# EAGLE design sprite (EAGLE 9.0.1)
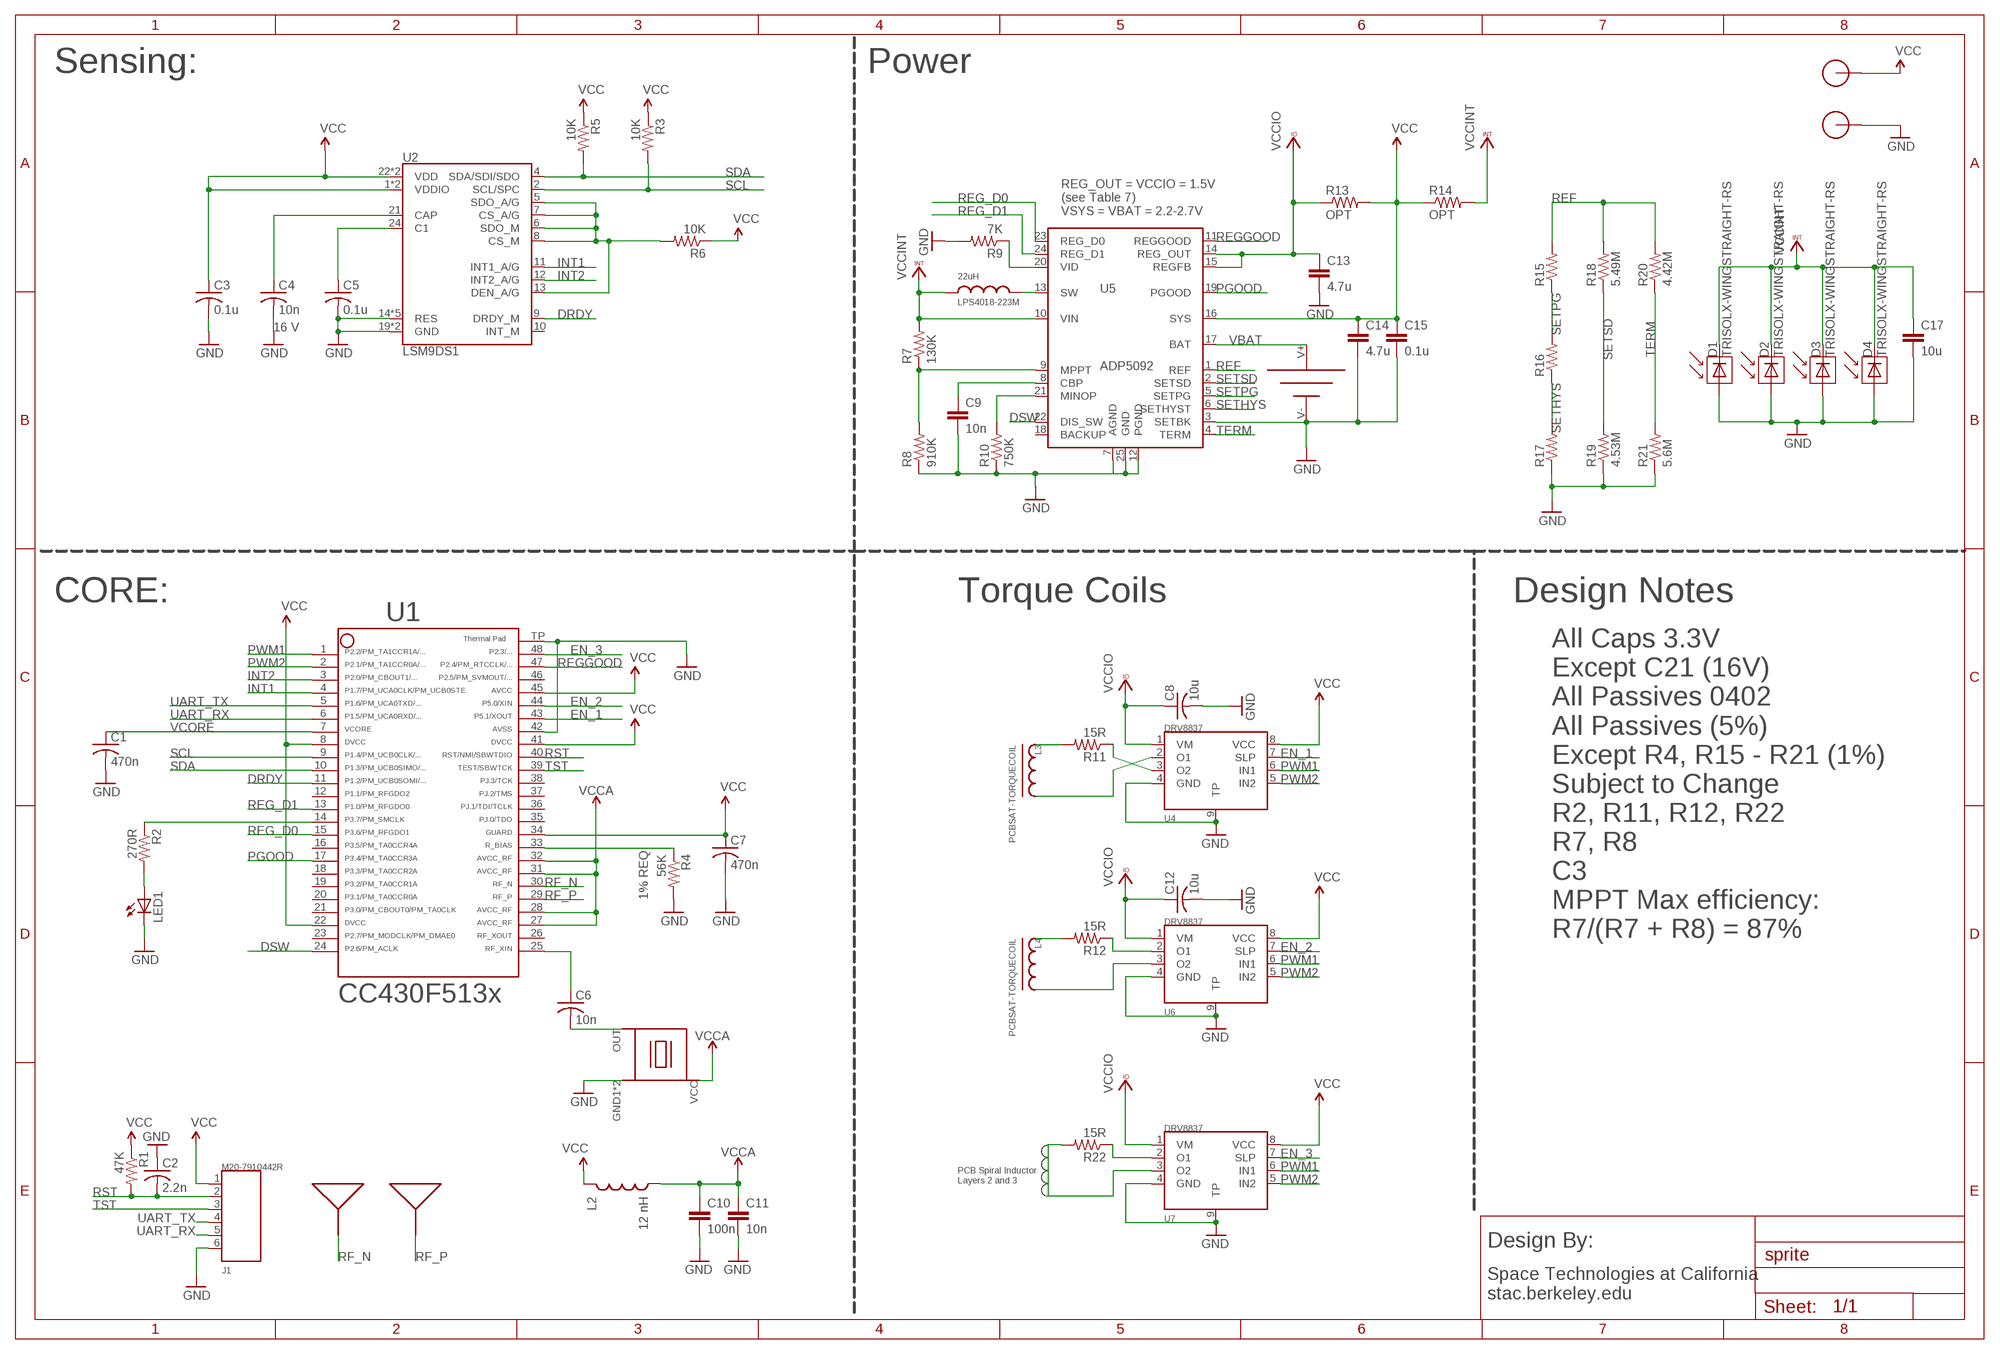
[diagram p0: schematic, sheet 1]

## Parts
A1  SPRITEANTENNA_ANTENNA  [SPRITEANTENNA_ANTENNA]
A2  SPRITEANTENNA_ANTENNA  [SPRITEANTENNA_ANTENNA]
B1  UMAC_UMAC  [UMAC_UMAC]
C1  470n  C-USC0402  [C0402]
C2  2.2n  C-USC0402  [C0402]
C3  0.1u  C-USC0402  [C0402]
C4  10n  C-USC0402  [C0402]
C5  0.1u  C-USC0402  [C0402]
C6  10n  C-USC0402  [C0402]
C7  470n  C-USC0402  [C0402]
C8  10u  C-USC0402  [C0402]
C9  10n  C-EUC0402  [C0402]
C10  100n  C-EUC0402  [C0402]
C11  10n  C-EUC0402  [C0402]
C12  10u  C-USC0402  [C0402]
C13  4.7u  C-EUC0402  [C0402]
C14  4.7u  C-EUC0402  [C0402]
C15  0.1u  C-EUC0402  [C0402]
C17  10u  C-EUC0402  [C0402]
D1  TRISOLX-WINGSTRAIGHT-RS  [TRISOLX-STRAIGHT-RS]
D2  TRISOLX-WINGSTRAIGHT-RS  [TRISOLX-STRAIGHT-RS]
D3  TRISOLX-WINGSTRAIGHT-RS  [TRISOLX-STRAIGHT-RS]
D4  TRISOLX-WINGSTRAIGHT-RS  [TRISOLX-STRAIGHT-RS]
J1  M20-7910442R  [M20-7910442R]
L1  LPS4018-223M  [LPS4018-223M]
L2  12 nH  INDUCTOR0603  [0603]
L3  PCBSAT-TORQUECOIL  [PCBSAT-TORQUECOIL]
L4  PCBSAT-TORQUECOIL  [PCBSAT-TORQUECOIL]
LED1  LED0603  [LED-0603]
R1  47K  R-US_R0402  [R0402]
R2  270R  R-US_R0402  [R0402]
R3  10K  R-US_R0402  [R0402]
R4  56K  R-US_R0402  [R0402]
R5  10K  R-US_R0402  [R0402]
R6  10K  R-US_R0402  [R0402]
R7  130K  R-US_R0402  [R0402]
R8  910K  R-US_R0402  [R0402]
R9  7K  R-US_R0402  [R0402]
R10  750K  R-US_R0402  [R0402]
R11  15R  R-US_R0402  [R0402]
R12  15R  R-US_R0402  [R0402]
R13  OPT  R-US_R0402  [R0402]
R14  OPT  R-US_R0402  [R0402]
R15  R-US_R0402  [R0402]
R16  R-US_R0402  [R0402]
R17  R-US_R0402  [R0402]
R18  5.49M  R-US_R0402  [R0402]
R19  4.53M  R-US_R0402  [R0402]
R20  4.42M  R-US_R0402  [R0402]
R21  5.6M  R-US_R0402  [R0402]
R22  15R  R-US_R0402  [R0402]
U1  CC430F513X  [TI_MSP430_V16_RGZ48]
U2  LSM9DS1  [LGA24-8X4]
U3  SPRITETCXO_TCXO_7Z  [SPRITETCXO_TXC_7Z]
U4  DRV8837  [SON50P200X200X75-8N]
U5  ADP5092  [QFN50P400X400X100-25N]
U6  DRV8837  [SON50P200X200X75-8N]
U7  DRV8837  [SON50P200X200X75-8N]
X1  SPRITEPIN_SPRITE_PIN  [SPRITEPIN_SPRITE_PIN]
X2  SPRITEPIN_SPRITE_PIN  [SPRITEPIN_SPRITE_PIN]

## Nets
DRDY: U1.11 U2.9(DRDY_M)
DSW: U1.24 U5.22(DIS_SW)
EN_1: U1.43 U4.7(SLP)
EN_2: U1.44 U6.7(SLP)
EN_3: U1.48 U7.7(SLP)
GND: B1.V- C1.2 C2.1 C3.2 C4.2 C5.2 C7.2 C8.2 C9.2 C10.2 C11.2 C12.2 C13.2 C14.2 C15.2 C17.2 D1.P$1(A) D2.P$1(A) D3.P$1(A) D4.P$1(A) J1.6 LED1.C R4.2 R8.1 R9.2 R10.1 R17.1 R19.1 R21.1 U1.42 U1.TP U2.14(RES) U2.15(RES) U2.16(RES) U2.17(RES) U2.18(RES) U2.19(GND) U2.20(GND) U3.GND1(GND) U3.GND2(GND) U4.4(GND) U4.9(TP) U5.3(SETBK) U5.7(AGND) U5.12(PGND) U5.25(GND) U6.4(GND) U6.9(TP) U7.4(GND) U7.9(TP) X2.PIN
INT1: U1.4 U2.11(INT1_A/G)
INT2: U1.3 U2.12(INT2_A/G)
N$1: C6.1 U1.25
N$2: R2.1 U1.14
N$3: R4.1 U1.33
N$4: L3.1 R11.2
N$5: C5.1 U2.24(C1)
N$6: C4.1 U2.21(CAP)
N$7: R6.2 U2.5(SDO_A/G) U2.6(SDO_M) U2.7(CS_A/G) U2.8(CS_M) U2.13(DEN_A/G)
N$8: R11.1 U4.3(O2)
N$9: L4.1 R12.2
N$11: LED1.A R2.2
N$12: C6.2 U3.OUT
N$13: R22.1 U7.2(O1)
N$14: L3.2 U4.2(O1)
N$16: R9.1 U5.20(VID)
N$18: R7.1 R8.2 U5.9(MPPT)
N$20: R10.2 U5.21(MINOP)
N$21: C9.1 U5.8(CBP)
N$22: L1.P$2 U5.13(SW)
N$26: R12.1 U6.2(O1)
N$27: L4.2 U6.3(O2)
N$28: R22.2 U7.3(O2)
PGOOD: U1.17 U5.19(PGOOD)
PWM1: U1.1 U4.6(IN1) U6.6(IN1) U7.6(IN1)
PWM2: U1.2 U4.5(IN2) U6.5(IN2) U7.5(IN2)
REF: R15.2 R18.2 R20.2 U5.1(REF)
REG_D0: U1.15 U5.23(REG_D0)
REG_D1: U1.13 U5.24(REG_D1)
REGGOOD: U1.47 U5.11(REGGOOD)
RF_N: A1.IN1(IN) A1.IN2(IN) A1.IN3(IN) U1.30
RF_P: A2.IN1(IN) A2.IN2(IN) A2.IN3(IN) U1.29
RST: C2.2 J1.2 R1.2 U1.40
SCL: R3.2 U1.9 U2.2(SCL/SPC)
SDA: R5.2 U1.10 U2.4(SDA/SDI/SDO)
SETHYS: R16.1 R17.2 U5.6(SETHYST)
SETPG: R15.1 R16.2 U5.5(SETPG)
SETSD: R18.1 R19.2 U5.2(SETSD)
TERM: R20.1 R21.2 U5.4(TERM)
TST: J1.3 U1.39
UART_RX: J1.5 U1.6
UART_TX: J1.4 U1.5
VBAT: B1.V+ U5.17(BAT)
VCC: C3.1 C7.1 C14.1 C15.1 J1.1 L2.1 R1.1 R3.1 R5.1 R6.1 R13.2 R14.1 U1.8 U1.22 U1.34 U1.41 U1.45 U2.1(VDDIO) U2.3(VDDIO) U2.22(VDD) U2.23(VDD) U4.8(VCC) U5.16(SYS) U6.8(VCC) U7.8(VCC) X1.PIN
VCCA: C10.1 C11.1 L2.2 U1.27 U1.28 U1.31 U1.32 U3.VCC
VCCINT: C17.1 D1.P$2(C) D2.P$2(C) D3.P$2(C) D4.P$2(C) L1.P$1 R7.2 R14.2 U5.10(VIN)
VCCIO: C8.1 C12.1 C13.1 R13.1 U4.1(VM) U5.14(REG_OUT) U5.15(REGFB) U6.1(VM) U7.1(VM)
VCORE: C1.1 U1.7
Unconnected: U1.12 U1.16 U1.18 U1.19 U1.20 U1.21 U1.23 U1.26 U1.35 U1.36 U1.37 U1.38 U1.46 U2.10(INT_M) U5.18(BACKUP)

## Notes on the sheet
- Sensing: | Power
- REG_OUT = VCCIO = 1.5V
  (see Table 7)
  VSYS = VBAT = 2.2-2.7V
- 16 V
- CORE: | Torque Coils | Design Notes
- 1% REQ
- All Caps 3.3V
  Except C21 (16V)
  All Passives 0402 
  All Passives (5%)
  Except R4, R15 - R21 (1%) 
  Subject to Change
  R2, R11, R12, R22
  R7, R8
  C3
  MPPT Max efficiency:
  R7/(R7 + R8) = 87%
- PCB Spiral Inductor
  Layers 2 and 3
- Design By:
- Space Technologies at California
  stac.berkeley.edu

## Library data of the parts
A1 A2 = STAC:SPRITEANTENNA_ANTENNA
B1 = STAC:UMAC_UMAC
C1-C8 C12 = rcl:C-US: CAPACITOR, American symbol; SPICEPREFIX: C
C9-C11 C13-C15 C17 = resistor:C-EU: CAPACITOR, European symbol
D1-D4 = STAC:TRISOLX-WING
J1 = STAC:M20-7910442R
L1 = STAC:LPS4018-223M: Datasheet: https://www.mouser.com/datasheet/2/597/lps4018-270702.pdf
L2 = SparkFun:INDUCTOR: Inductors Basic Inductor/Choke - 0603 and 1206. Footprints are not proven and vary greatly between part numbers.
L3 L4 = STAC:PCBSAT-TORQUECOIL
LED1 = SparkFun:LED: LEDs Standard schematic elements and footprints for 5mm, 3mm, 1206, and 0603 sized LEDs. 5mm - Spark Fun Electronics SKU : COM-00529 (and others)
R1-R22 = resistor:R-US_: RESISTOR, American symbol
U1 = STAC:CC430F513X: ***CC430F513X***RGZ48 ** ** Rev 1.0 ** 06/2010 * http://focus.ti.com/docs/prod/folders/print/cc430f5137.html
U2 = SparkFun-Sensors:LSM9DS1: LSM9DS1 3D accelerometer, gyroscope & magnetometer The LSM9DS1 is a system-in-package featuring a 3D digital linear acceleration sensor, a 3D digital angular rate sensor, and a 3D digital magnetic sensor. The LSM9DS1 has a linear acceleration full scale of ±2g/±4g/±8/±16 g, a magnetic field full scale of ±4/±8/±12/±16 gauss and an angular rate of ±245/±500/±2000 dps. The LSM9DS1 includes an I2 C serial bus interface supporting standard and fast mode (100 kHz and 400 kHz) and an SPI serial standard interface. Magnetic, accelerometer and gyroscope sensing can be enabled or set in power-down mode separately for smart power management. The LSM9DS1 is available in a plastic land grid array package (LGA) and it is guaranteed to operate over an extended temperature range from -40 °C to +85 °C.; PROD_ID: IC-12536
U3 = STAC:SPRITETCXO_TCXO_7Z
U4 U6 U7 = STAC:DRV8837
U5 = STAC:ADP5092
X1 X2 = STAC:SPRITEPIN_SPRITE_PIN

## Board
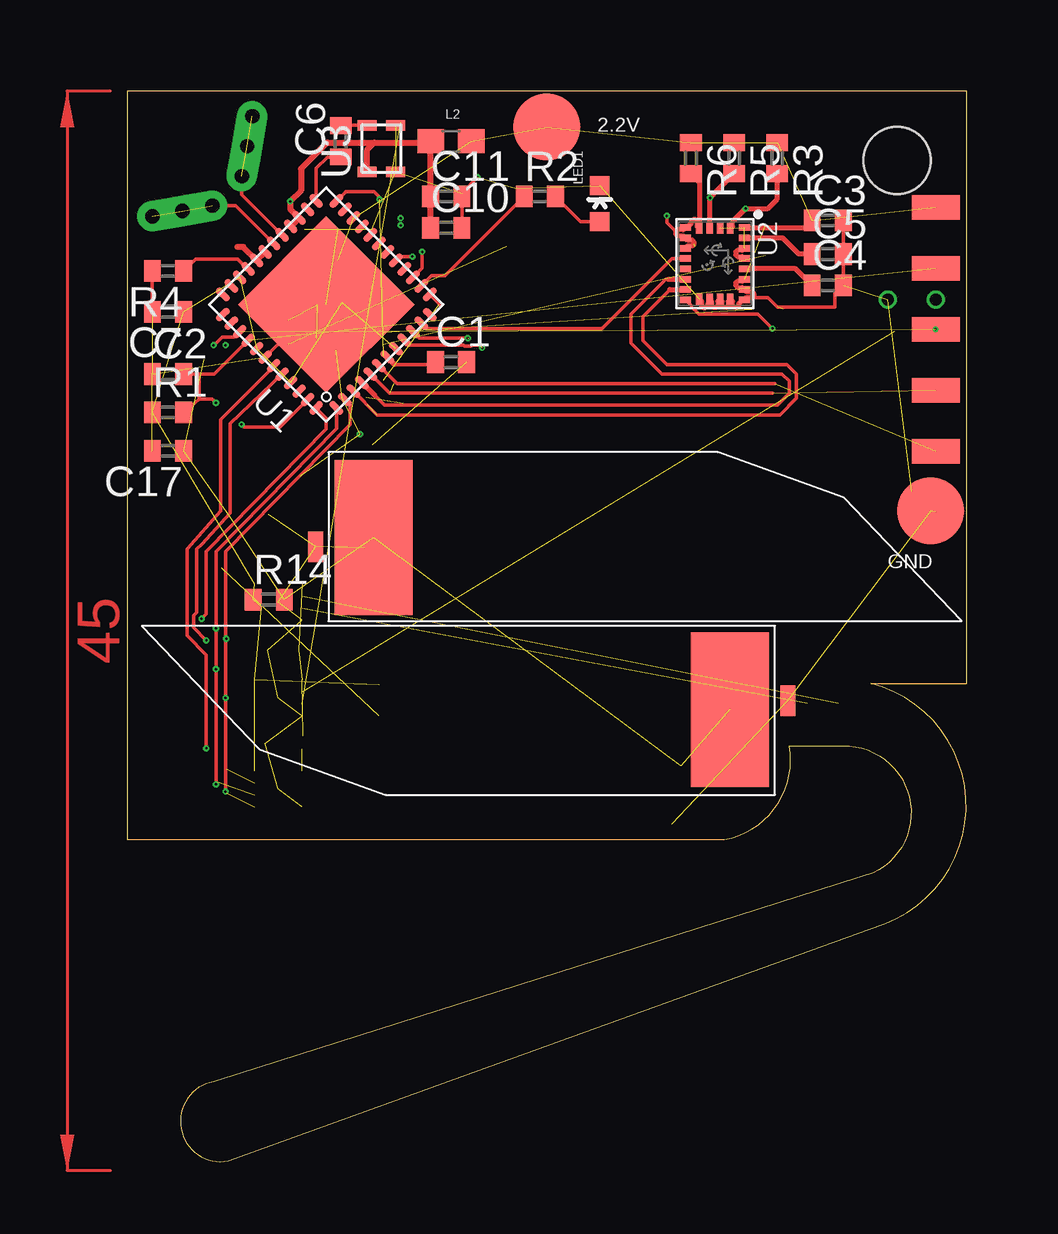
[diagram p1: board, top side]
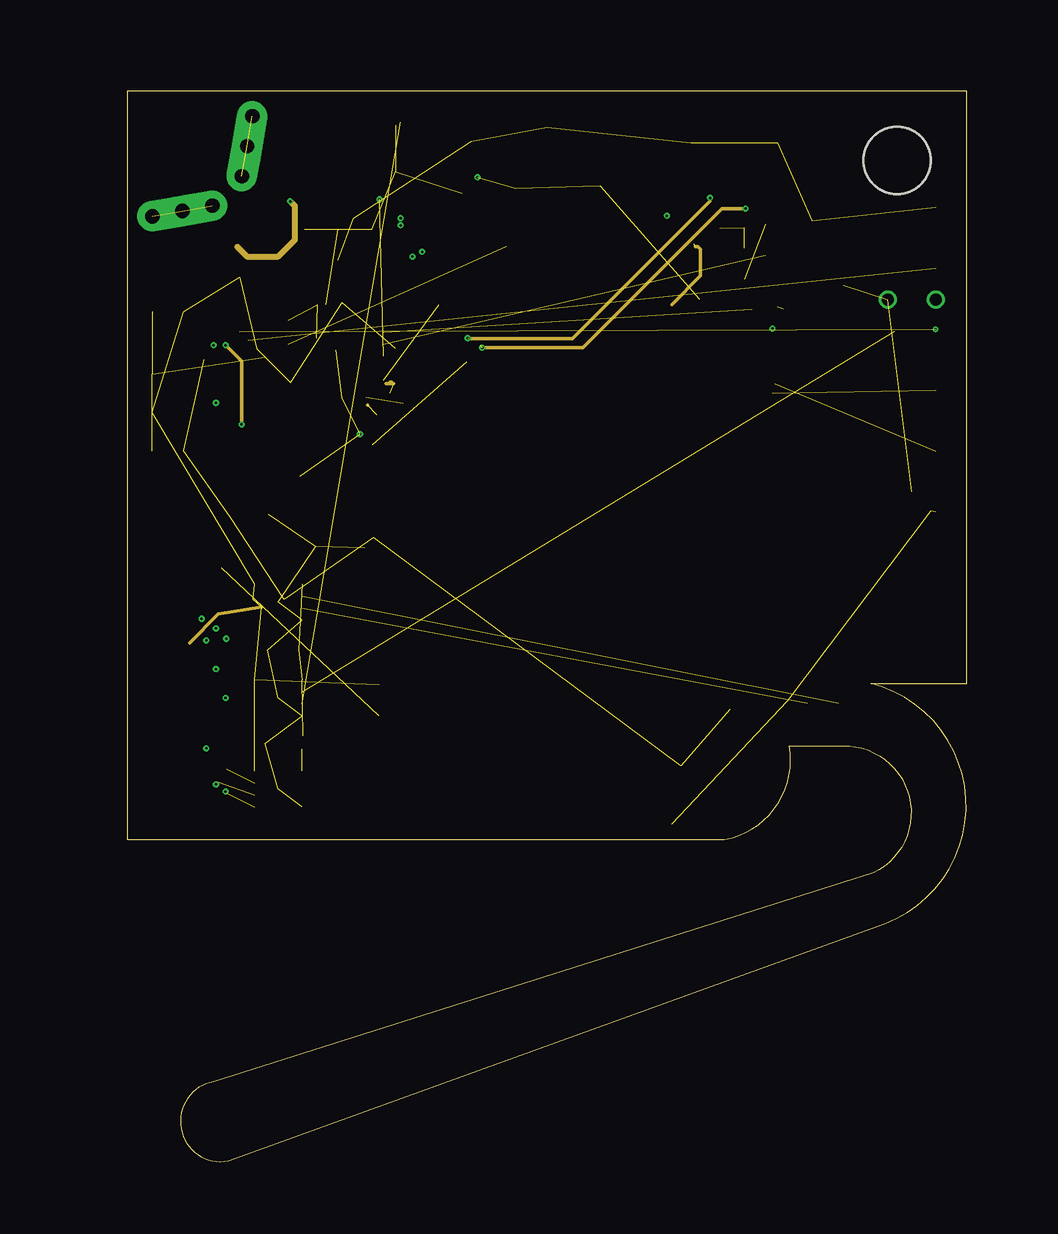
[diagram p2: board, inner layer Route2]
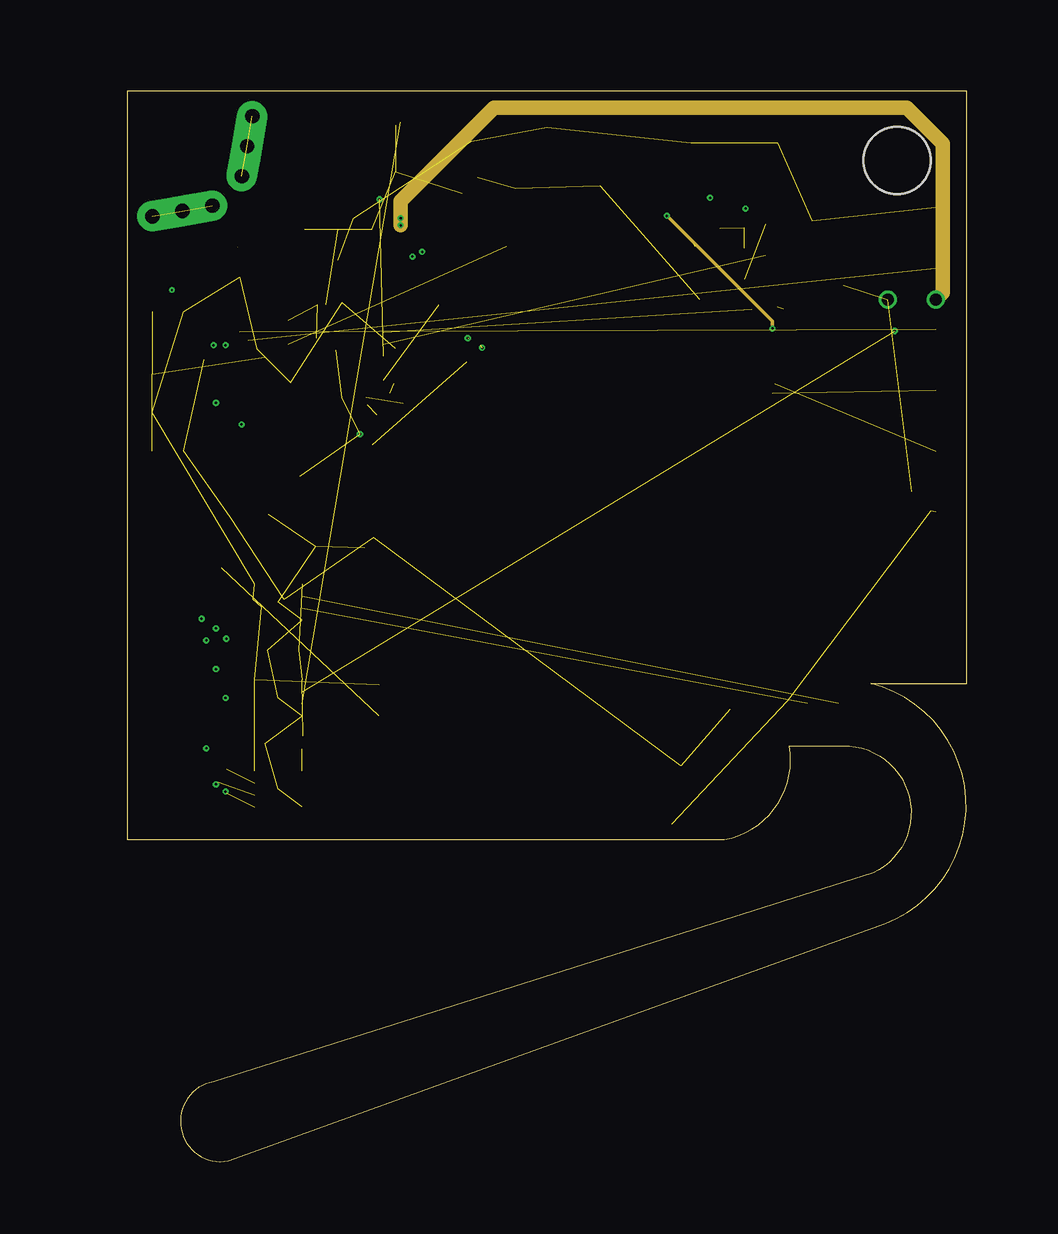
[diagram p3: board, inner layer Route3]
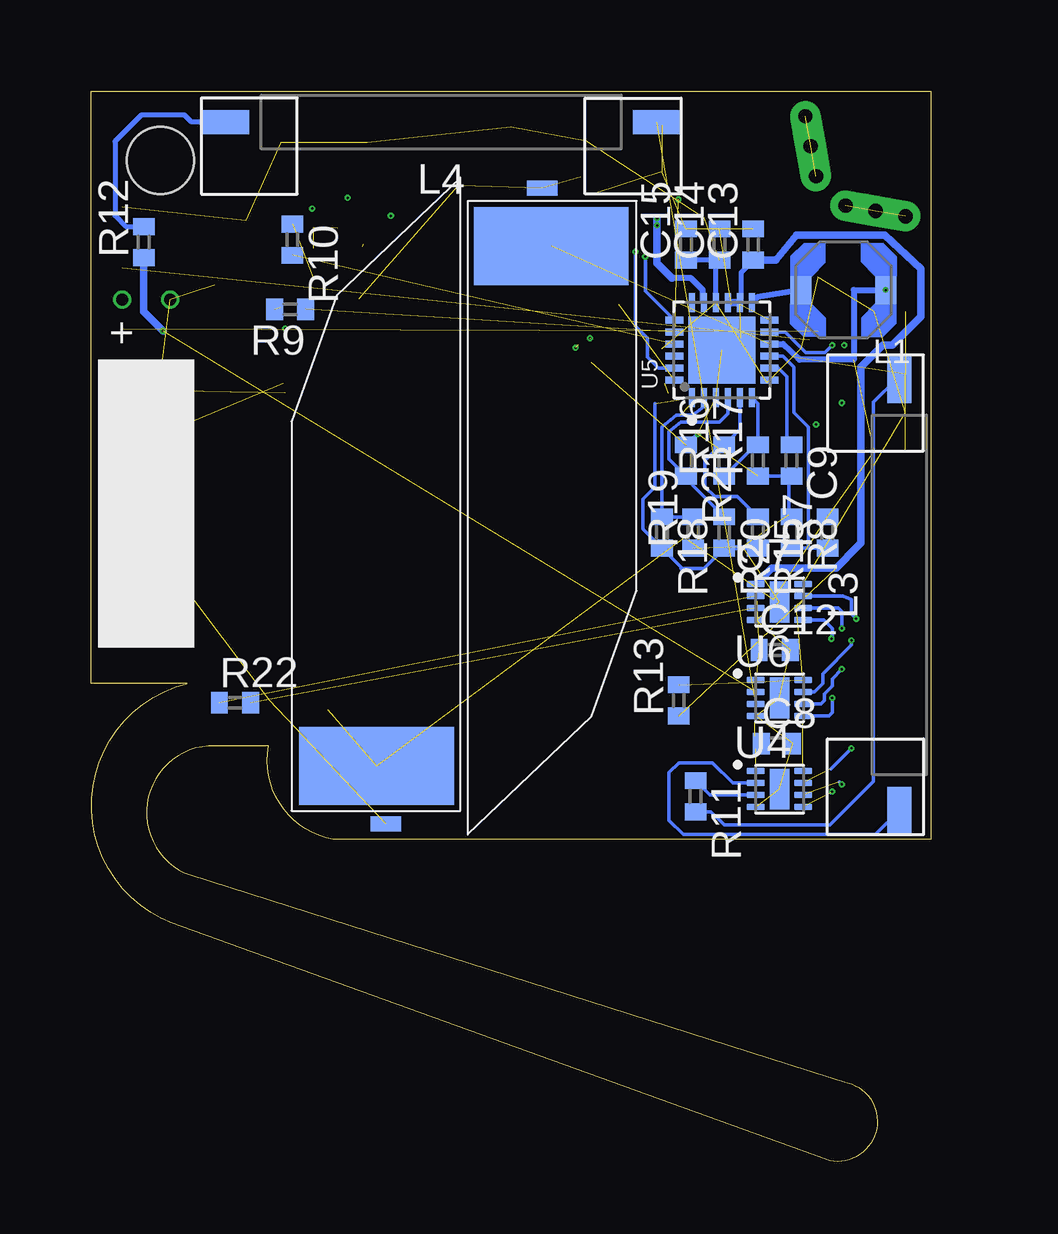
[diagram p4: board, bottom side, seen from below]

Size 35 x 44.63 mm. Coordinates in mm from the lower left corner, seen from the top.
Outline: 0,13.43 24.9,13.43 arc90 27.6,17.33 30.1,17.33 arc-150 31.1,12.03 3.6,3.33 arc180 4.2,0.03 31.6,9.93 arc145 31,19.93 35,19.93 35,44.63 0,44.63 0,13.43
Copper layers [2:(1+2*3+16):3]: Top 0.053340625mm / dielectric 10mil / Route2 0.035559375mm / dielectric 14mil / Route3 0.035559375mm / dielectric 10mil / Bottom 0.053340625mm
Design rules "BayAreaAdvanced *": minimum track width 2mil, minimum drill 4mil, track to track 2mil, track to pad 5mil, pad to pad 5mil, via to via 5mil, smd to smd 5mil, copper to edge 5mil, drill to drill 6mil, minimum pad ring 3mil, minimum via ring 3mil, stop-mask expansion 4mil, vias tented up to drill 0mil, thermal gap 10mil
Holes 2.8 mm at 32.1,41.73

### Footprints (pad centres in the part's own frame; a part is rotated, then mirrored left to right if it is on the bottom)
SPRITEANTENNA_ANTENNA = drill 0.6 pad 1.27 square: IN1 0,0 | drill 0.6 pad 1.27 offset: IN2 1.27,0; IN3 -1.27,0
UMAC_UMAC = drill 0.5: V+ 2.5,1; V- 2.5,-1
C0402 = smd 0.7 x 0.9: 1 -0.65,0; 2 0.65,0
TRISOLX-STRAIGHT-RS = smd 0.635 x 1.27: P$1 -12.446,0.508 | smd 3.251 x 6.452: P$2 -10.033,0.889
M20-7910442R = smd 1.02 x 2: 1 -6.35,0; 2 -3.81,0; 3 -1.27,0; 4 1.27,0; 5 3.81,0; 6 6.35,0
LPS4018-223M = smd 0.87 x 1.15: P$1 -1.765,0; P$2 1.765,0
0603 = smd 1.1 x 1: 1 -0.85,0; 2 0.85,0
PCBSAT-TORQUECOIL = smd 2 x 1: 1 -9,0; 2 9,0
LED-0603 = smd 0.8 x 0.8: A 0,-0.75; C 0,0.75
R0402 = smd 0.7 x 0.9: 1 -0.65,0; 2 0.65,0
TI_MSP430_V16_RGZ48 = smd 0.7 x 0.3: 1 -3.35,2.75; 2 -3.35,2.25; 3 -3.35,1.75; 4 -3.35,1.25; 5 -3.35,0.75; 6 -3.35,0.25; 7 -3.35,-0.25; 8 -3.35,-0.75; 9 -3.35,-1.25; 10 -3.35,-1.75; 11 -3.35,-2.25; 12 -3.35,-2.75; 25 3.35,-2.75; 26 3.35,-2.25; 27 3.35,-1.75; 28 3.35,-1.25; 29 3.35,-0.75; 30 3.35,-0.25; 31 3.35,0.25; 32 3.35,0.75; 33 3.35,1.25; 34 3.35,1.75; 35 3.35,2.25; 36 3.35,2.75 | smd 0.3 x 0.7: 13 -2.75,-3.35; 14 -2.25,-3.35; 15 -1.75,-3.35; 16 -1.25,-3.35; 17 -0.75,-3.35; 18 -0.25,-3.35; 19 0.25,-3.35; 20 0.75,-3.35; 21 1.25,-3.35; 22 1.75,-3.35; 23 2.25,-3.35; 24 2.75,-3.35; 37 2.75,3.35; 38 2.25,3.35; 39 1.75,3.35; 40 1.25,3.35; 41 0.75,3.35; 42 0.25,3.35; 43 -0.25,3.35; 44 -0.75,3.35; 45 -1.25,3.35; 46 -1.75,3.35; 47 -2.25,3.35; 48 -2.75,3.35 | smd 5.2 x 5.2: TP 0,0
LGA24-8X4 = smd 0.27 x 0.45: 1 -1.505,1.225; 6 -1.505,-1.225; 7 -1.075,-1.225; 8 -0.645,-1.225; 9 -0.215,-1.225; 10 0.215,-1.225; 11 0.645,-1.225; 12 1.075,-1.225; 13 1.505,-1.225; 18 1.505,1.225; 19 1.075,1.225; 20 0.645,1.225; 21 0.215,1.225; 22 -0.215,1.225; 23 -0.645,1.225; 24 -1.075,1.225 | smd 0.45 x 0.27: 2 -1.475,0.645; 3 -1.475,0.215; 4 -1.475,-0.215; 5 -1.475,-0.645; 14 1.475,-0.645; 15 1.475,-0.215; 16 1.475,0.215; 17 1.475,0.645
SPRITETCXO_TXC_7Z = smd 0.44 x 0.79: GND1 -0.97,-0.595; GND2 0.97,-0.595; OUT 0.97,0.595; VCC -0.97,0.595
SON50P200X200X75-8N = smd 0.76 x 0.27: 1 -0.985,0.75; 2 -0.985,0.25; 3 -0.985,-0.25; 4 -0.985,-0.75; 5 0.985,-0.75; 6 0.985,-0.25; 7 0.985,0.25; 8 0.985,0.75 | smd 0.81 x 1.7: 9 0,0
QFN50P400X400X100-25N = smd 0.76 x 0.26: 1 -1.98,1.25; 2 -1.98,0.75; 3 -1.98,0.25; 4 -1.98,-0.25; 5 -1.98,-0.75; 6 -1.98,-1.25; 13 1.98,-1.25; 14 1.98,-0.75; 15 1.98,-0.25; 16 1.98,0.25; 17 1.98,0.75; 18 1.98,1.25 | smd 0.26 x 0.76: 7 -1.25,-1.98; 8 -0.75,-1.98; 9 -0.25,-1.98; 10 0.25,-1.98; 11 0.75,-1.98; 12 1.25,-1.98; 19 1.25,1.98; 20 0.75,1.98; 21 0.25,1.98; 22 -0.25,1.98; 23 -0.75,1.98; 24 -1.25,1.98 | smd 2.8 x 2.8: 25 0,0
SPRITEPIN_SPRITE_PIN = smd 2.794 x 2.794: PIN 0,0

### Placement (x,y rotation side)
A1  2.3,39.63 10 top
A2  5,42.33 80 top
B1  32.7,33.43 90 bottom
C1  13.5,33.33 0 top
C2  1.7,32.83 0 top
C3  29.2,39.23 0 top
C4  29.2,36.53 0 top
C5  29.2,37.83 0 top
C6  8.9,42.53 90 top
C7  1.7,35.43 180 top
C8  6.4,17.43 0 bottom
C9  5.8,29.23 270 bottom
C10  13.3,38.93 0 top
C11  13.3,40.23 0 top
C12  6.5,21.33 0 bottom
C13  7.4,38.23 90 bottom
C14  8.8,38.23 90 bottom
C15  10.2,38.23 90 bottom
C17  1.7,29.63 180 top
D1  15.1,19.73 180 top
D2  20.3,25.13 0 top
D3  16.7,28.13 270 bottom
D4  22.2,26.53 90 bottom
J1  33.7,33.43 270 top
L1  3.63,36.33 180 bottom
L2  13.5,42.53 180 top
L3  1.3,23.63 270 bottom
L4  20.4,43.33 0 bottom
LED1  19.7,39.93 0 top
R1  1.7,31.23 0 top
R2  17.2,40.23 0 top
R3  27.1,41.83 270 top
R4  1.7,37.13 180 top
R5  25.3,41.83 270 top
R6  23.5,41.83 270 top
R7  4.3,26.23 90 bottom
R8  5.8,26.23 270 bottom
R9  26.7,35.53 180 bottom
R10  26.6,38.43 270 bottom
R11  9.8,15.23 270 bottom
R12  32.8,38.33 90 bottom
R13  10.5,19.23 90 bottom
R14  5.9,23.43 0 top
R15  7.2,26.23 270 bottom
R16  8.6,29.23 90 bottom
R17  7.2,29.23 90 bottom
R18  11.2,26.23 270 bottom
R19  9.9,26.23 90 bottom
R20  8.6,26.23 270 bottom
R21  10.2,29.23 270 bottom
R22  29,19.13 0 bottom
U1  8.3,35.73 135 top
U2  24.5,37.43 270 top
U3  10.6,42.23 90 top
U4  6.3,15.53 0 bottom
U5  8.7,33.83 90 bottom
U6  6.3,19.33 0 bottom
U7  6.3,23.33 0 bottom
X1  17.5,43.13 0 top
X2  33.5,27.13 0 top

### Tracks (layer width: path | path; a pad name or v marks a point on that pad's centre or on a via)
DRDY
  Top 0.152: U2.9 22.71,37.64 19.8,34.73 12.48,34.73 U1.11
DSW  (via drill 0.1)  (1 unrouted)
  Top 0.152: U1.24 9.1,40.42 9.1,40.43 10.3,40.43 10.5,40.23 10.5,40.13 v10.52,40.11
EN_1  (via drill 0.1)  (1 unrouted)
  Top 0.152: U1.43 6.11,33.13 3.9,30.93 3.9,27.13 2.5,25.53 2.5,21.93 3.3,21.13 v3.3,17.23
  Bottom 0.152: v3.3,17.23 4.15,16.38
EN_2  (via drill 0.1)
  Top 0.152: U1.44 4.3,30.77 4.3,27.03 3.1,25.73 2.9,25.53 2.9,22.89 2.77,22.76 2.77,22.26 v3.3,21.73
  Bottom 0.152: U6.7 4.85,19.58 4.5,19.93 4.5,20.33 3.3,21.53 v3.3,21.73
EN_3  (via drill 0.1)
  Top 0.152: v3.1,22.63 3.3,22.83 3.3,25.43 8.3,30.53 8.3,30.99 U1.48
  Bottom 0.152: v3.1,22.63 3.3,22.83 3.3,23.43 3.65,23.58 U7.7
GND  (via drill 0.1, 0.1 layers 1-2)  (36 unrouted)
  Top 0.152: R4.2 C7.2 | C10.2 C11.2 13.95,40.38 v14.6,41.03 | C3.2 C5.2 C4.2 29.5,36.18 29.5,35.63 27.1,35.63 26.72,36.01 26.05,36.01 | U1.42 7.95,35.73 U1.TP | U3.GND2 11.2,43.33
  Top 0.203: U2.20 25.64,36.69 25.45,36.69 25.37,36.62 25.37,36.51 25.45,36.44 25.64,36.44 U2.19 25.81,36.26 26.05,36.26 26.13,36.19 26.13,36.08 26.05,36.01 25.81,36.01 U2.18 25.7,35.95 25.49,35.74 25.49,35.67 25.41,35.6 25.31,35.6 25.23,35.67 25.23,35.86 U2.17 25.06,35.86 25.06,35.67 24.98,35.6 24.88,35.6 24.8,35.67 24.8,35.86 U2.16 24.63,35.86 24.63,35.67 24.55,35.6 24.45,35.6 24.37,35.67 24.37,35.86 24.36,35.88 | 24.36,35.88 U2.15 | 24.36,35.88 24.2,35.72 24.2,35.67 24.12,35.6 24.02,35.6 23.94,35.67 23.94,35.86 U2.14
  Top 0.508: X2.PIN 32.7,27.93
  Bottom 0.152: C9.2 5.9,28.58 | 5.9,28.58 R17.1 | R8.1 5.9,26.98 5.9,28.58 | R21.1 9.75,30.33 v9.7,30.33
  Bottom 0.203: 7.9,34.33 U5.25
INT1
  Top 0.152: 10.33,31.93 10.73,31.53 27.1,31.53 27.6,32.03 27.6,32.53 27.3,32.83 22.3,32.83 21,34.13 21,35.33 22.45,36.78 22.55,36.78
  Top 0.203: U1.4 10.33,31.93 | 22.55,36.78 U2.11
INT2  (1 unrouted)
  Top 0.152: 22.62,36.35 21.5,35.23 21.5,34.23 22.5,33.23 27.5,33.23 27.9,32.83 27.9,31.83 27.2,31.13 10.43,31.13 U1.3
  Top 0.203: 22.62,36.35 U2.12
  Route2 0.152: 10.01,31.54 10.03,31.53
N$1
  Top 0.152: C6.1 8.35,41.88 7.88,41.4 U1.25
N$2
  Top 0.152: U1.14 12.68,36.93 13.25,36.93 R2.1
N$3
  Top 0.152: U1.33 5.01,37.21 4.6,37.63 2.85,37.63 R4.1
N$4
  Bottom 0.152: L3.1 1.41,32.63 2.38,31.66 2.38,15.85 4.2,14.03 8.6,14.03 9.15,14.58 R11.2
N$5
  Top 0.203: C5.1 28,37.83 27.32,38.5 U2.24
N$6
  Top 0.203: C4.1 27.86,37.21 U2.21
N$7  (via drill 0.1)  (1 unrouted)
  Top 0.152: 23.35,38.14 U2.8 | U2.13 23.52,35.68 23.52,35.64 23.83,35.33 26.3,35.33 v26.9,34.73 | 22.87,38.77 22.5,39.14 v22.5,39.43
  Top 0.203: R6.2 23.86,40.82 U2.5 23.77,38.99 23.77,39.18 23.69,39.25 23.59,39.25 23.51,39.18 23.51,39.11 23.3,38.9 U2.6 23.19,38.84 22.95,38.84 22.87,38.77 22.87,38.66 22.95,38.59 23.19,38.59 U2.7 23.36,38.41 23.55,38.41 23.63,38.34 23.63,38.23 23.55,38.16 23.36,38.16 U2.8
  Route2 0.152: 22.7,35.73 23.9,36.93 23.9,38.03 23.78,38.14 23.68,38.14
  Route3 0.152: v22.5,39.43 26.9,35.03 v26.9,34.73
N$8
  Bottom 0.152: U4.3 9.2,15.28 R11.1
N$9
  Bottom 0.203: L4.1 30.8,43.33 31.1,43.63 32.9,43.63 34,42.53 34,39.43 33.55,38.98 R12.2
N$11
  Top 0.152: R2.2 18.9,39.18 LED1.A
N$12
  Top 0.152: C6.2 8.92,43.2 U3.OUT
N$13  (1 unrouted)
N$14
  Bottom 0.152: L3.2 2.3,13.63 10.3,13.63 10.9,14.23 10.9,16.23 10.5,16.63 9.1,16.63 8.25,15.78 U4.2
N$16  (1 unrouted)
N$18
  Bottom 0.152: R7.1 5.1,25.58 | 5.1,25.58 R8.2 | 5.1,25.58 5.1,30.63 5.7,31.23 5.7,33.13 6.15,33.58 U5.9
N$20  (1 unrouted)
N$21
  Bottom 0.152: C9.1 6,30.08 6,32.73 6.35,33.08 U5.8
N$22
  Bottom 0.254: L1.P$2 7.23,36.03 U5.13
N$26  (via drill 0.1 layers 3-16)  (1 unrouted)
  Bottom 0.305: R12.1 32.8,35.43 v32,34.63
N$27  (1 unrouted)
N$28  (1 unrouted)
PGOOD  (via drill 0.1)
  Top 0.152: v11.9,37.72 11.36,37.72 U1.17
  Bottom 0.152: v11.9,37.72 11.9,36.29 U5.19
PWM1  (via drill 0.1)  (1 unrouted)
  Top 0.152: U1.1 8.72,30.55 3.7,25.43 v3.7,22.23 v3.7,20.53 v3.7,15.73
  Bottom 0.152: U7.6 3.85,23.08 3.7,22.93 v3.7,22.23 | 3.8,15.83 v3.7,15.73 | v3.7,20.53 4.1,20.13 4.1,19.83 4.43,19.5 4.43,19.23 4.58,19.08 U6.6
PWM2  (via drill 0.1)  (1 unrouted)
  Top 0.152: 4.1,21.83 v4.1,19.33 v4.1,15.43 | 4.1,21.83 4.1,25.43 9.29,30.72 9.29,31.55 U1.2 | v4.13,21.79 4.1,21.83
  Bottom 0.152: U7.5 4.45,22.58 4.1,22.23 4.1,21.83 v4.13,21.79 | 4.15,15.38 v4.1,15.43 | v4.1,19.33 4.1,18.73 4.25,18.58 U6.5
REF  (1 unrouted)
  Bottom 0.152: 11.5,31.6 11.5,28.13 12,27.63 12,26.38 R18.2 10.4,24.78 10.4,24.73 9.45,24.73 R20.2
  Bottom 0.203: R15.2 R20.2
REG_D0  (via drill 0.1)
  Top 0.152: U1.15 12.3,37.25 v12.3,37.93
  Bottom 0.152: U5.23 11.35,33.08 11.8,33.53 11.8,34.33 12.3,34.83 v12.3,37.93
REG_D1  (1 unrouted)
  Top 0.152: U1.13 13,35.76 13,35.73
REGGOOD  (via drill 0.1)
  Top 0.152: U1.47 6.38,30.63 4.87,30.63 v4.77,30.73
  Route2 0.152: v4.77,30.73 4.77,33.36 v4.1,34.03
  Bottom 0.152: U5.11 6.05,34.58 5.2,33.73 4.4,33.73 v4.1,34.03 | v4.77,30.73 4.8,30.73
RF_N  (2 unrouted)
  Top 0.152: U1.30 4.53,39.85 A1.IN2
RF_P  (2 unrouted)
  Top 0.152: U1.29 4.78,40.31 A2.IN3
RST  (via drill 0.1)  (1 unrouted)
  Top 0.152: 3,32.83 C2.2 | R1.2 3,31.78 | 3,31.78 3,32.83 | 3,32.83 3.63,32.83 U1.40 | 3,31.78 3.55,31.78 v3.7,31.63
SCL  (via drill 0.1)  (1 unrouted)
  Top 0.152: U1.9 11.77,34.03 14.03,34.03 14.06,34 14.34,34 14.37,34.03 14.7,34.03 v14.8,33.93
  Top 0.203: U2.2 25.23,38.99 25.23,39.18 v25.78,39.73 26.7,39.73 27.1,40.13 R3.2
  Route2 0.152: v25.78,39.73 24.8,39.73 19,33.93 v14.8,33.93
SDA  (via drill 0.1)  (1 unrouted)
  Top 0.152: U1.10 12.18,34.33 v14.2,34.33
  Top 0.203: U2.4 v24.3,40.18 R5.2
  Route2 0.152: v24.3,40.18 24.3,40.03 18.57,34.3 14.2,34.3
SETHYS
  Bottom 0.152: U5.6 7.2,31.6 R17.2 7.3,29.88 R16.1
SETPG
  Bottom 0.152: R16.2 8.38,30.1 | 8.38,30.1 7.95,30.53 U5.5 | R15.1 8.05,27.73 9,27.73 9.4,28.13 9.4,29.23 8.53,30.1 8.38,30.1
SETSD
  Bottom 0.152: U5.2 9.45,31.48 9.9,31.13 10.6,31.13 11.2,30.63 R18.1 R19.2
TERM
  Bottom 0.152: R20.1 9.9,28.18 R21.2 10.9,29.28 10.9,30.43 10.4,30.83 8.8,30.83 8.45,31.18 U5.4
TST  (via drill 0.08 layers 1-2, 0.1)  (1 unrouted)
  Top 0.152: U1.39 4.46,34.36 3.96,34.36 3.63,34.03 v3.6,34.03
  other vias: 33.7,34.7
UART_RX  (1 unrouted)
  Top 0.152: U1.6 11.25,32.43 27,32.43
UART_TX  (2 unrouted)
  Top 0.152: U1.5 10.94,32.03 26.9,32.03
  Route2 0.152: 10.8,32.43 11.1,32.43 11.03,32.5 10.96,32.5
VBAT  (via drill 0.1)
  Route3 0.61: B1.V+ 34,36.23 34,42.43 32.5,43.93 15.3,43.93 11.4,40.03 v11.4,39.03
  Bottom 0.152: v11.4,39.03 v11.4,39.33
  Bottom 0.254: U5.17 9.5,35.86 9.5,36.33 10,36.83 10.77,36.83
  Bottom 0.305: v11.4,39.33 11.4,37.45 10.77,36.83
VCC  (22 unrouted)
  Top 0.203: U2.1 28.25,38.93 C3.1 | U2.23 25.64,37.98 25.45,37.98 25.37,37.91 25.37,37.8 25.45,37.73 25.64,37.73 U2.22
  Route2 0.152: 2.6,21.63 3.8,22.83 5.6,23.13
  Bottom 0.203: U5.16 8.95,37.43 C14.1 C15.1
VCCA  (via drill 0.1 layers 1-2)  (1 unrouted)
  Top 0.254: U1.31 U1.32 4.84,38.13 4.6,38.13 | U1.28 U1.27 6.8,39.7 v6.8,40.03 7.25,40.47 7.25,41.38 8.35,42.48 10.3,42.48 | C10.1 C11.1 L2.2 12.6,42.48 10.3,42.48 | U3.VCC 10.01,42.19 10.3,42.48
  Route2 0.254: 4.6,38.13 5,37.73 6.3,37.73 7,38.43 7,39.83 v6.8,40.03
VCCINT  (via drill 0.08 layers 3-16)  (7 unrouted)
  Bottom 0.254: U5.10 6.15,34.08 5.53,33.5 5.45,33.43 3.2,33.43 3.2,36.33 L1.P$1
  other vias: 1.87,36.33
VCCIO  (5 unrouted)
  Bottom 0.152: 7.33,17.75 C8.1 7.29,17.19
  Bottom 0.203: C13.1 7.9,37.06 7.9,35.86 U5.14
  Bottom 0.305: U5.14 U5.15 | C13.1 6.45,37.58 5.6,38.63 1.9,38.63 0.4,37.23 0.4,35.23 1.6,34.03 2,34.03 2.9,33.13 2.9,25.78 3.03,25.65 3.93,24.75 6.61,24.75 U7.1
VCORE
  Top 0.152: 11.15,33.23 12.75,33.23 C1.1
  Top 0.203: U1.7 11.15,33.23
(copper drawn outside any net)
  shapes: Top area x1

### Text on the board
tNames: 2.2V | GND
201bmp: Sprite v2.6